# Altium schematic sheet TP_IHM_7SEG.SchDoc
size A4
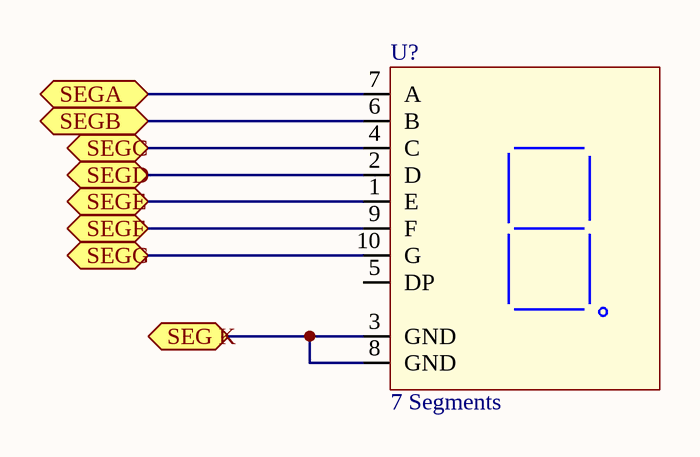
[diagram p0: TP_IHM_7SEG.SchDoc]

## Parts
U?  7 Segments  [SA10-21GWA]

## Ports
SEG K, SEGA, SEGB, SEGC, SEGD, SEGE, SEGF, SEGG

## Nets
SEG K: U?.3(GND) U?.8(GND) ; port SEG K
SEGA: U?.7(A) ; port SEGA
SEGB: U?.6(B) ; port SEGB
SEGC: U?.4(C) ; port SEGC
SEGD: U?.2(D) ; port SEGD
SEGE: U?.1(E) ; port SEGE
SEGF: U?.9(F) ; port SEGF
SEGG: U?.10(G) ; port SEGG

Not connected (* = marked no-connect by the designer): U? 5(DP)

## Library data of the parts
U? = SC10-21SRWA: KingBright Led 7 Segments; Reference: SC10-21SRWA